# EAGLE design expansion_module_USB_host (EAGLE 9.6.2)
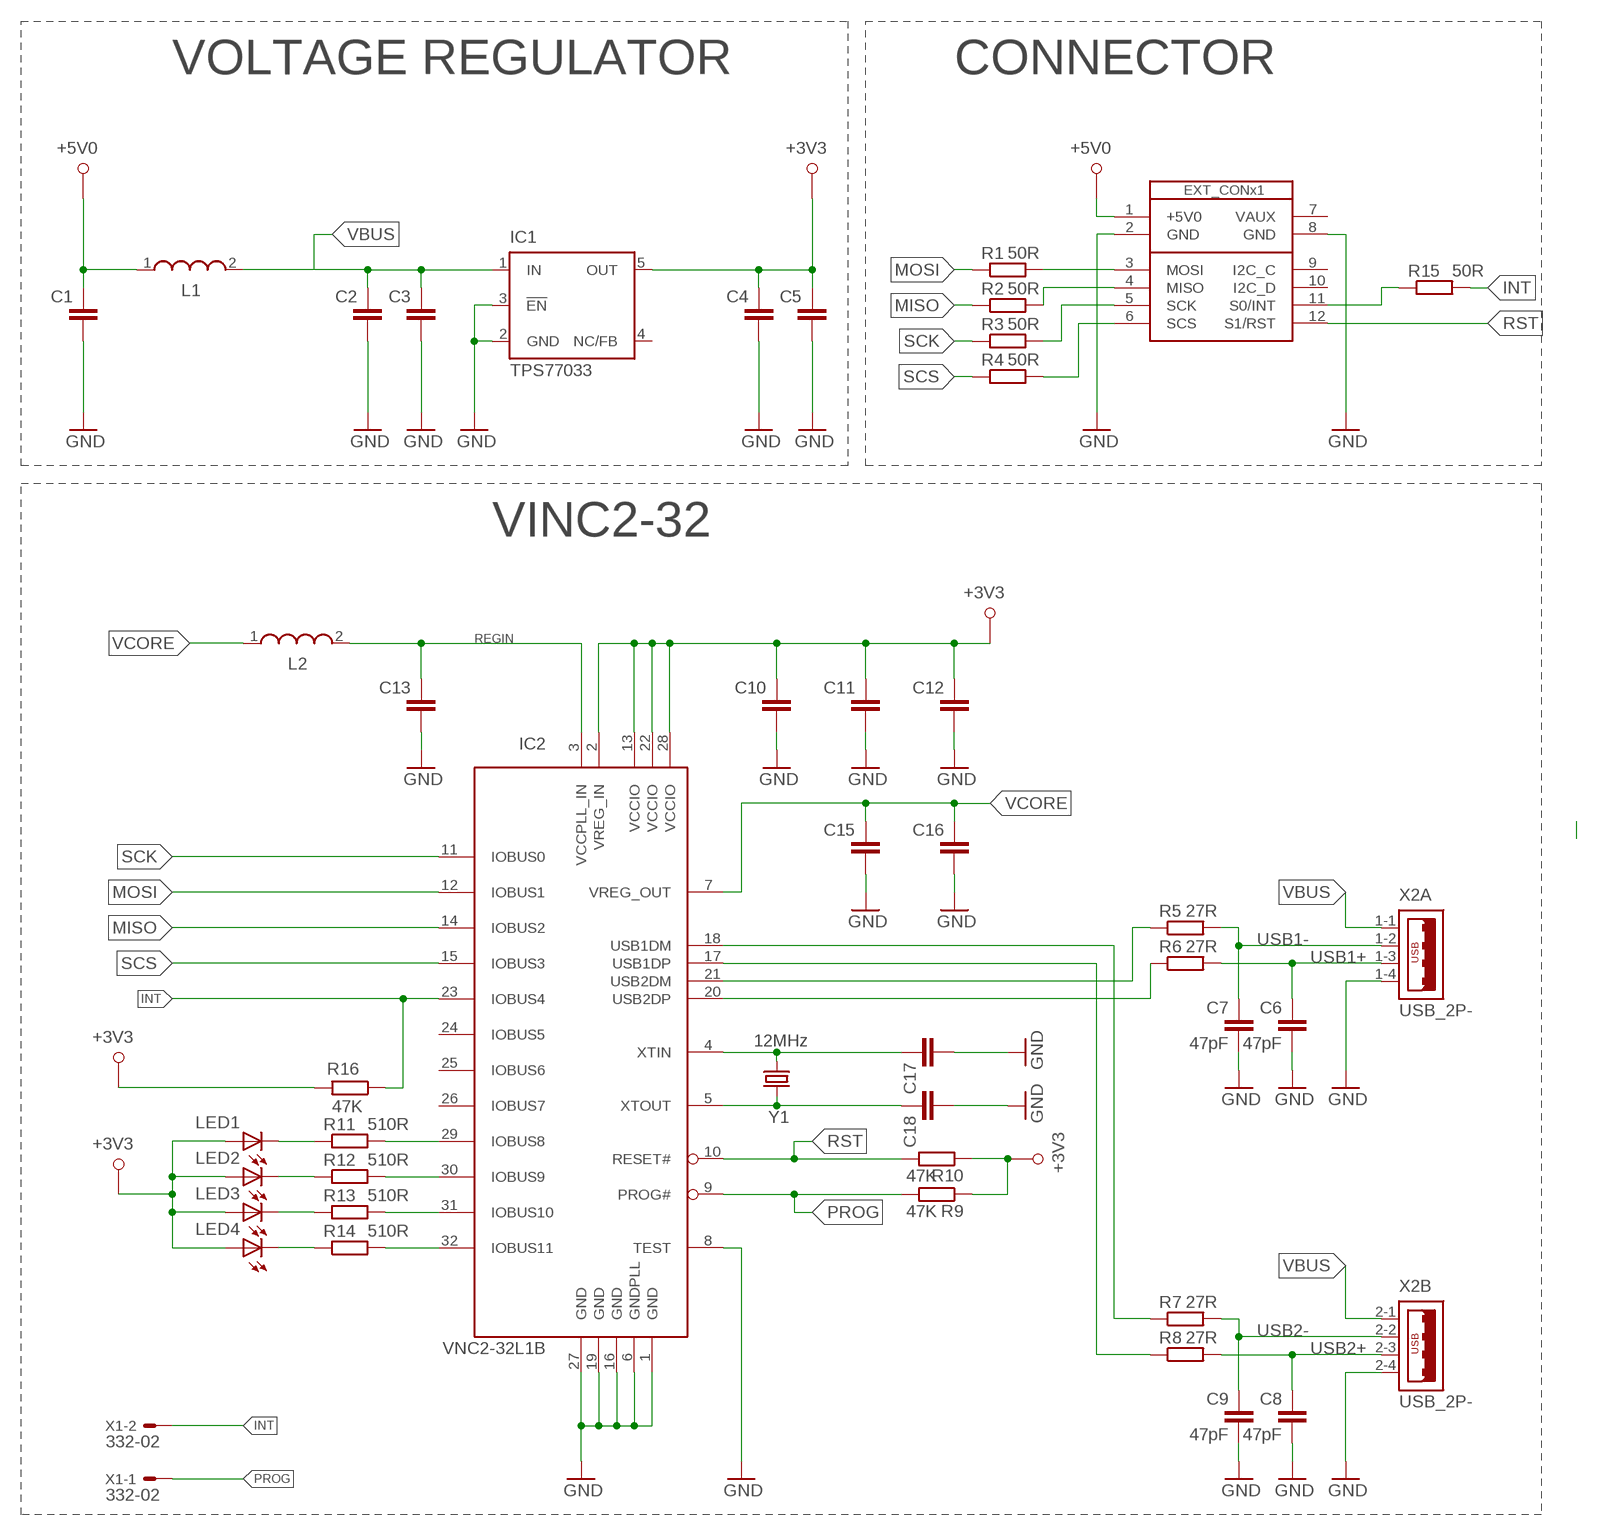
[diagram p0: schematic, sheet 1]

## Parts
C1  C-EUC0805  [C0805]
C2  C-EUC0805  [C0805]
C3  C-EUC0805  [C0805]
C4  C-EUC0805  [C0805]
C5  C-EUC0805  [C0805]
C6  47pF  C-EUC0805  [C0805]
C7  47pF  C-EUC0805  [C0805]
C8  47pF  C-EUC0805  [C0805]
C9  47pF  C-EUC0805  [C0805]
C10  C-EUC0805  [C0805]
C11  C-EUC0805  [C0805]
C12  C-EUC0805  [C0805]
C13  C-EUC0805  [C0805]
C15  C-EUC0805  [C0805]
C16  C-EUC0805  [C0805]
C17  C-EUC0805  [C0805]
C18  C-EUC0805  [C0805]
IC1  TPS77033  [SOT23-DBV]
IC2  VNC2-32L1B  [LQFP32]
L1  WE-LQ_1210  [WE-LQ_M]
L2  WE-LQ_1210  [WE-LQ_M]
LED1  LEDCHIPLED_0805  [CHIPLED_0805]
LED2  LEDCHIPLED_0805  [CHIPLED_0805]
LED3  LEDCHIPLED_0805  [CHIPLED_0805]
LED4  LEDCHIPLED_0805  [CHIPLED_0805]
R1  50R  R-EU_R0805  [R0805]
R2  50R  R-EU_R0805  [R0805]
R3  50R  R-EU_R0805  [R0805]
R4  50R  R-EU_R0805  [R0805]
R5  27R  R-EU_R0805  [R0805]
R6  27R  R-EU_R0805  [R0805]
R7  27R  R-EU_R0805  [R0805]
R8  27R  R-EU_R0805  [R0805]
R9  47K  R-EU_R0805  [R0805]
R10  47K  R-EU_R0805  [R0805]
R11  510R  R-EU_R0805  [R0805]
R12  510R  R-EU_R0805  [R0805]
R13  510R  R-EU_R0805  [R0805]
R14  510R  R-EU_R0805  [R0805]
R15  50R  R-EU_R0805  [R0805]
R16  47K  R-EU_R0805  [R0805]
U$1  SB_EXT_CON_X1_SPI  [SB_EXT_CON_X1_FULL]
X1  332-02  [332-02]
X2  USB_2P-  [85-32003-00X-1_DUAL]
Y1  12MHz  CRYSTALCRYSTAL-SMD-5X3-12MHZ  [CRYSTAL-SMD-5X3]

## Nets
+3V3: C4.2 C5.2 C10.2 C11.2 C12.2 IC1.5(OUT) IC2.2(VREG_IN) IC2.13(VCCIO) IC2.22(VCCIO) IC2.28(VCCIO) LED1.A LED2.A LED3.A LED4.A R9.1 R10.1 R16.2
+5V0: C1.2 L1.1 U$1.1(+5V0)
GND: C1.1 C2.1 C3.1 C4.1 C5.1 C6.1 C7.1 C8.1 C9.1 C10.1 C11.1 C12.1 C13.1 C15.1 C16.1 C17.1 C18.1 IC1.2(GND) IC1.3(!EN) IC2.1(GND) IC2.6(GNDPLL) IC2.8(TEST) IC2.16(GND) IC2.19(GND) IC2.27(GND) U$1.2(GND) U$1.8(GND) X2.1-4 X2.2-4
INT: IC2.23(IOBUS4) R15.2 R16.1 X1.2
MISO: IC2.14(IOBUS2) R2.1
MOSI: IC2.12(IOBUS1) R1.1
N$1: R1.2 U$1.3(MOSI)
N$2: R2.2 U$1.4(MISO)
N$3: R3.2 U$1.5(SCK)
N$4: R4.2 U$1.6(SCS)
N$6: LED1.C R11.1
N$7: IC2.29(IOBUS8) R11.2
N$8: C17.2 IC2.4(XTIN) Y1.1
N$9: IC2.21(USB2DM) R5.1
N$11: C18.2 IC2.5(XTOUT) Y1.3
N$12: IC2.18(USB1DM) R7.1
N$13: IC2.17(USB1DP) R8.1
N$14: IC2.30(IOBUS9) R12.2
N$16: IC2.31(IOBUS10) R13.2
N$17: IC2.32(IOBUS11) R14.2
N$22: LED2.C R12.1
N$23: LED3.C R13.1
N$24: LED4.C R14.1
N$25: IC2.20(USB2DP) R6.1
N$33: R15.1 U$1.11(S0/INT)
PROG: IC2.9(PROG#) R9.2 X1.1
REGIN: C13.2 IC2.3(VCCPLL_IN) L2.2
RST: IC2.10(RESET#) R10.2 U$1.12(S1/RST)
SCK: IC2.11(IOBUS0) R3.1
SCS: IC2.15(IOBUS3) R4.1
USB1+: C6.2 R6.2 X2.1-3
USB1-: C7.2 R5.2 X2.1-2
USB2+: C8.2 R8.2 X2.2-3
USB2-: C9.2 R7.2 X2.2-2
VBUS: C2.2 C3.2 IC1.1(IN) L1.2 X2.1-1 X2.2-1
VCORE: C15.2 C16.2 IC2.7(VREG_OUT) L2.1
Unconnected: IC1.4(NC/FB) IC2.24(IOBUS5) IC2.25(IOBUS6) IC2.26(IOBUS7) U$1.7(VAUX) U$1.9(I2C_C) U$1.10(I2C_D)

## Notes on the sheet
- VOLTAGE REGULATOR | CONNECTOR
- VINC2-32

## Library data of the parts
C1-C13 C15-C18 = resistor:C-EU: CAPACITOR, European symbol
IC1 = texas:TPS770*: ULTRALOW-POWER 50-mA LOW-DROPOUT LINEAR REGULATORS 50-mA Low-Dropout Regulator Source: http://focus.ti.com/lit/ds/symlink/tps77001.pdf; MF: TEXAS INSTRUMENTS; MPN: TPS77033DBVT; OC_FARNELL: 8461570; OC_NEWARK: 77C1187
IC2 = ftdichip-6:VNC2-32: Vinculum-II 2nd Generation Dual USB Host Controller
L1 L2 = EagleLibrary_Wuerth_Elektronik_eiSos_rev16a:WE-LQ: SMD Inductor Characteristics Miniature chip inductor wound on a special ferrite core Small inductances for compact circuits High Q at high frequencies Low DC-resistance Operating temperature: –40 ºC to +125 ºC Applications Low power DC/DC-converters from Linear Technology, National Semiconductor, Texas Instruments, Fairchild Semiconductor, ON Semiconductor, STMicroelectronics, Maxim, MPS, Semtech, Exar, Analogic Tech, Diodes and Cologne Chip EMI-Filtering RF-circuits <http://katalog.we-online.de/media/images/eisos/IndLQ_pf2.jpg> Details see: http://katalog.we-online.de/en/pbs/WE-LQ? Updated by Dan Xu 2014-07-08 2014 (C) Wurth Elektronik
LED1-LED4 = adafruit:LED: LED OSRAM: - CHIPLED LG R971, LG N971, LY N971, LG Q971, LY Q971, LO R971, LY R971 LH N974, LH R974 LS Q976, LO Q976, LY Q976 LO Q996 - Hyper CHIPLED LW Q18S LB Q993, LB Q99A, LB R99A - SideLED LS A670, LO A670, LY A670, LG A670, LP A670 LB A673, LV A673, LT A673, LW A673 LH A674 LY A675 LS A676, LA A676, LO A676, LY A676, LW A676 LS A679, LY A679, LG A679 - Hyper Micro SIDELED® LS Y876, LA Y876, LO Y876, LY Y876 LT Y87S - SmartLED LW L88C, LW L88S LB L89C, LB L89S, LG L890 LS L89K, LO L89K, LY L89K LS L896, LA L896, LO L896, LY L896 - TOPLED LS T670, LO T670, LY T670, LG T670, LP T670 LSG T670, LSP T670, LSY T670, LOP T670, LYG T670 LG T671, LOG T671, LSG T671 LB T673, LV T673, LT T673, LW T673 LH T674 LS T676, LA T676, LO T676, LY T676, LB T676, LH T676, LSB T676, LW T676 LB T67C, LV T67C, LT T67C, LS T67K, LO T67K, LY T67K, LW E67C LS E67B, LA E67B, LO E67B, LY E67B, LB E67C, LV E67C, LT E67C LW T67C LS T679, LY T679, LG T679 LS T770, LO T770, LY T770, LG T770, LP T770 LB T773, LV T773, LT T773, LW T773 LH T774 LS E675, LA E675, LY E675, LS T675 LS T776, LA T776, LO T776, LY T776, LB T776 LHGB T686 LT T68C, LB T68C - Hyper Mini TOPLED® LB M676 - Mini TOPLED Santana® LG M470 LS M47K, LO M47K, LY M47K Source: http://www.osram.convergy.de/
R1-R16 = resistor:R-EU_: RESISTOR, European symbol
U$1 = al_smartboard:SB_EXT_CON_X1_SPI
X1 = con-garry:332-02: 2 Pin - 2mm Dual Row Source: www.mpe-connector.de / garry_shortform_2012.pdf
X2 = con-cypressindustries_2:USB_2P-: Triple USB Connector Source: www.cypressindustries.com
Y1 = SparkFun-FreqCtrl:CRYSTAL: Various standard crystals. Proven footprints.; PROD_ID: XTAL-08297

## Net classes
0 default: clearance 0.205 mm

## Board
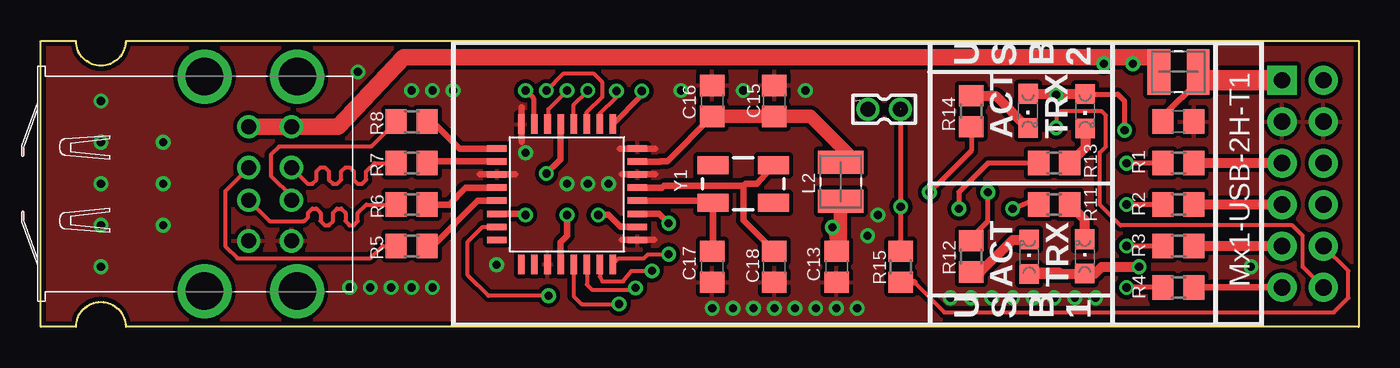
[diagram p1: board, top side]
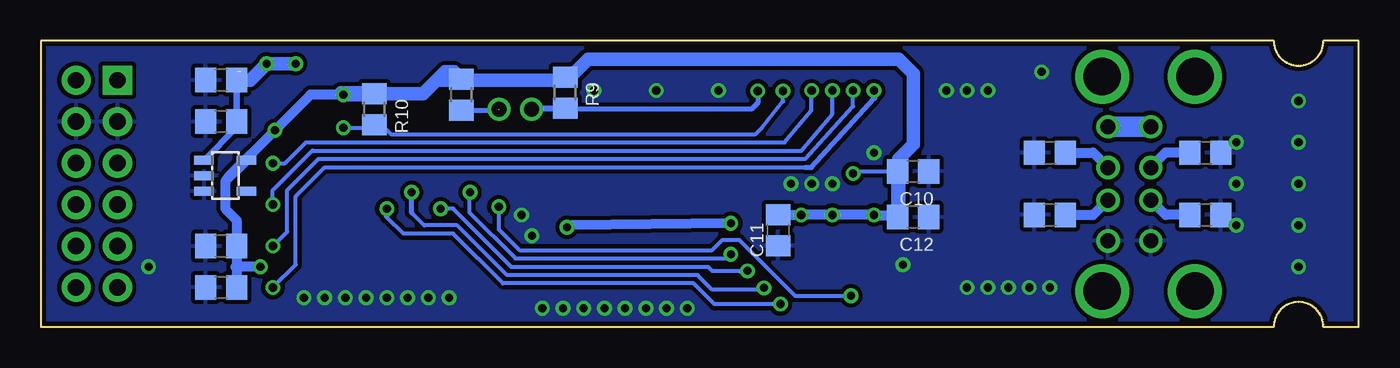
[diagram p2: board, bottom side, seen from below]

Size 80.77 x 17.53 mm. Coordinates in mm from the lower left corner, seen from the top.
Copper layers (1*16): Top 0.035mm / dielectric 1.5mm / Bottom 0.035mm
Design rules "default *": minimum track width 10mil, minimum drill 24mil, track to track 8mil, track to pad 8mil, pad to pad 8mil, via to via 8mil, smd to smd 8mil, copper to edge 10mil, drill to drill 20mil, minimum pad ring 10mil, minimum via ring 8mil, stop-mask expansion 4mil, vias tented up to drill 30mil, thermal gap 10mil

### Footprints (pad centres in the part's own frame; a part is rotated, then mirrored left to right if it is on the bottom)
C0805 = smd 1.3 x 1.5: 1 -0.95,0; 2 0.95,0
SOT23-DBV = smd 0.55 x 1.2: 1 -0.95,-1.3; 2 0,-1.3; 3 0.95,-1.3; 4 0.95,1.3; 5 -0.95,1.3
LQFP32 = smd 0.4 x 1.2: 1 -2.8,-4.3; 2 -2,-4.3; 3 -1.2,-4.3; 4 -0.4,-4.3; 5 0.4,-4.3; 6 1.2,-4.3; 7 2,-4.3; 8 2.8,-4.3; 17 2.8,4.3; 18 2,4.3; 19 1.2,4.3; 20 0.4,4.3; 21 -0.4,4.3; 22 -1.2,4.3; 23 -2,4.3; 24 -2.8,4.3 | smd 1.2 x 0.4: 9 4.3,-2.8; 10 4.3,-2; 11 4.3,-1.2; 12 4.3,-0.4; 13 4.3,0.4; 14 4.3,1.2; 15 4.3,2; 16 4.3,2.8; 25 -4.3,2.8; 26 -4.3,2; 27 -4.3,1.2; 28 -4.3,0.4; 29 -4.3,-0.4; 30 -4.3,-1.2; 31 -4.3,-2; 32 -4.3,-2.8
WE-LQ_M = smd 1.4 x 2.8: 1 -1.2,0; 2 1.2,0
CHIPLED_0805 = smd 1.2 x 1.2: A 0,-1.05; C 0,1.05
R0805 = smd 1.3 x 1.5: 1 -0.95,0; 2 0.95,0
SB_EXT_CON_X1_FULL = drill 1 pad 1.778 square: 1 15.24,5.08 | drill 1 pad 1.778: 2 12.7,5.08; 3 10.16,5.08; 4 7.62,5.08; 5 5.08,5.08; 6 2.54,5.08; 7 15.24,2.54; 8 12.7,2.54; 9 10.16,2.54; 10 7.62,2.54; 11 5.08,2.54; 12 2.54,2.54
332-02 = drill 0.9 pad 1.27: 1 0,-1; 2 0,1
85-32003-00X-1_DUAL = drill 0.92 pad 1.27: 1-1 2.71,3.5; 1-2 2.71,1; 1-3 2.71,-1; 1-4 2.71,-3.5; 2-1 5.33,3.5; 2-2 5.33,1; 2-3 5.33,-1; 2-4 5.33,-3.5 | drill 2.3 pad 3: M1 0,6.57; M2 0,-6.57; M3 5.68,6.57; M4 5.68,-6.57
CRYSTAL-SMD-5X3 = smd 1.9 x 1.1: 1 -1.85,-1.15; 2 1.85,-1.15; 3 1.85,1.15; 4 -1.85,1.15

### Placement (x,y rotation side)
C1  69.72,12.57 180 top
C2  69.72,15.11 0 bottom
C3  69.72,12.57 0 bottom
C4  69.72,2.41 0 bottom
C5  69.72,4.95 0 bottom
C6  9.4,6.86 180 bottom
C7  9.4,10.67 180 bottom
C8  18.92,6.86 0 bottom
C9  18.92,10.67 0 bottom
C10  27.3,9.53 180 bottom
C11  35.59,5.92 90 bottom
C12  27.3,6.73 180 bottom
C13  48.77,3.68 90 top
C15  44.96,13.84 270 top
C16  41.15,13.84 270 top
C17  41.15,3.68 90 top
C18  44.96,3.68 90 top
IC1  69.47,9.27 270 bottom
IC2  32.26,8.13 90 top
L1  69.72,15.62 180 top
L2  49.02,8.89 270 top
LED1  63.98,4.32 0 top
LED2  60.58,4.29 0 top
LED3  64.01,13.21 180 top
LED4  60.5,13.23 180 top
R1  69.72,10.03 0 top
R2  69.72,7.49 0 top
R3  69.72,4.95 0 top
R4  69.72,2.41 0 top
R5  22.73,4.95 180 top
R6  22.73,7.49 180 top
R7  22.73,10.03 180 top
R8  22.73,12.57 180 top
R9  48.64,14.35 270 bottom
R10  60.33,13.33 270 bottom
R11  62.1,7.49 180 top
R12  57.02,4.32 90 top
R13  62.1,10.03 180 top
R14  57.02,13.21 270 top
R15  52.7,3.68 90 top
R16  54.99,14.22 90 bottom
U$1  81.15,-0.13 90 top
X1  51.69,13.33 270 top
X2  10.03,8.76 0 top
Y1  43.05,8.76 0 top

### Tracks (layer width: path | path; a pad name or v marks a point on that pad's centre or on a via)
+3V3  (via drill 0.5)
  Top 0.305: LED3.A 66.01,14.26 66.42,13.84 v66.42,12.04
  Top 0.406: IC2.22 29.65,6.93 v29.72,6.86 | IC2.28 31.86,5.19 32.26,5.59 v32.26,6.86 | IC2.2 35.53,6.13 34.8,6.86 v34.16,6.86 | IC2.13 31.86,10.27 v30.99,9.4
  Top 0.61: LED4.A 63.98,14.28 LED3.A | v67.31,3.68 65.02,3.68 64.61,3.27 LED1.A LED2.A 60.89,3.3 62.48,3.3
  Bottom 0.254: v30.99,9.4 30.86,9.53 C10.2 | C4.2 68.77,3.62 68.83,3.68
  Bottom 0.305: R10.1 60.39,14.22 v62.23,14.22
  Bottom 0.406: C5.2 68.71,4.95 | C10.2 28.26,6.88 28.13,6.76
  Bottom 0.61: 69.47,8.92 69.22,9.27 v66.42,12.04 64.24,14.22 v62.23,14.22 | 69.47,8.92 69.47,7.24 68.77,6.54 C5.2 C4.2 | IC1.5 69.47,8.92 | 28.13,6.76 28.34,6.8 29.52,6.8 v29.72,6.86 v32.26,6.86 v34.16,6.86 C11.2 | v67.31,3.68 68.83,3.68
  Bottom 0.813: 59.88,14.22 v62.23,14.22 62.36,14.35 60.57,14.35 LED4.A 57.34,14.28 56.52,15.11 | 56.52,15.11 48.83,15.11 R9.1 48.33,15.3 47.24,16.38 28.19,16.38 27.3,15.49 27.3,11.18 28.19,10.29 28.19,6.79 C12.2 C10.2 28.07,9.71 | 56.52,15.11 56.01,15.62 55.44,15.62 R16.2
+5V0
  Top 0.406: C1.2 68.77,12.89 70.99,15.11 70.99,15.55 L1.1
  Top 1.27: U$1.1 70.99,15.11
GND  (via drill 0.5)
  Top 0.406: 26.92,9.35 29.06,9.35 | 29.46,13.46 29.46,11.33 | 37.64,10.92 35.51,10.92 | 37.64,9.35 35.61,9.35 | 35.61,5.33 37.59,5.33
  other vias: 19.43,15.62 7.49,6.22 7.49,8.76 7.49,11.3 3.68,13.84 3.68,11.3 3.68,8.76 3.68,6.22 3.68,3.68 18.92,2.41 20.19,2.41 21.46,2.41 22.73,2.41 24,2.41 24,14.48 22.73,14.48 25.27,14.48 29.72,10.67 34.8,8.76 33.53,8.76 32.26,8.76 57.02,1.78 58.29,1.78 59.56,1.78 60.83,1.78 62.1,1.78 63.37,1.78 64.64,1.78 55.75,1.78 43.05,14.48 46.86,14.48 39.24,14.48 48.77,1.14 44.96,1.14 41.15,1.14 42.42,1.14 43.69,1.14 46.23,1.14 47.5,1.14 50.04,1.14 50.67,5.59 51.31,6.86 74.17,3.68 27.94,3.81
  pour Top (isolate 0.254): 81.25,17.81 -0.13,17.78 -0.13,-1.52 81.31,-1.52
  pour Bottom (isolate 0.254): 81.28,18.16 81.28,-0.13 -0.13,-0.13 -0.13,18.16
INT  (via drill 0.5)  (1 unrouted)
  Top 0.254: v31.12,1.91 27.43,1.91 26.16,3.17 26.16,5.21 27.08,6.13 IC2.23
  Top 0.305: R15.2 v52.7,7.37 52.7,13.33
  Bottom 0.254: v52.7,7.37 52.7,5.97 51.44,4.7 39.62,4.7 38.99,5.33 37.97,5.33 34.54,1.91 v31.12,1.91
  Bottom 0.305: R16.1 52.75,13.27 X1.2
MISO  (via drill 0.5)
  Top 0.254: IC2.14 31.12,12.43 31.12,13.33 v32.26,14.48
  Top 0.305: R2.1 v66.55,7.49
  Bottom 0.254: v66.55,7.49 66.55,8.38 64.14,10.79 34.16,10.79 32.26,13.03 v32.26,14.48
MOSI  (via drill 0.5)
  Top 0.254: IC2.12 32.66,13.61 v33.53,14.48
  Top 0.305: R1.1 v66.55,10.03
  Bottom 0.254: v66.55,10.03 65.79,10.03 64.52,11.3 35.18,11.3 33.55,13.26 v33.53,14.48
N$1
  Top 0.61: U$1.3 R1.2
N$2
  Top 0.61: U$1.4 R2.2
N$3
  Top 0.61: U$1.5 R3.2
N$4
  Top 0.406: U$1.6 R4.2
N$5  (via drill 0.5)
  other vias: 65.15,16.13
N$6
  Top 0.61: LED1.C 63.98,6.56 R11.1
N$7  (via drill 0.5)
  Top 0.254: IC2.29 32.66,1.88 33.15,1.4 v35.43,1.4
  Top 0.305: R11.2 60.9,7.75 v59.56,7.24
  Bottom 0.254: v35.43,1.4 39.5,1.4 40.77,2.67 52.45,2.67 55.5,5.71 58.55,5.71 59.56,6.73
  Bottom 0.305: 59.56,6.73 v59.56,7.24
N$8
  Top 0.406: C17.2 41.2,4.69 Y1.1 41.09,7.73 IC2.4
N$9
  Top 0.406: R5.1 24,4.95 26.78,7.73 IC2.21
N$11
  Top 0.406: Y1.3 43.88,8.76 43.18,8.76 43.05,8.64 | 43.05,8.64 43.05,6.54 C18.2 | 43.05,8.64 38.19,8.64 38.08,8.53 IC2.5
N$12
  Top 0.406: R7.1 24,10.03 24.13,10.16 27.93,10.16 IC2.18
N$13
  Top 0.406: R8.1 24,12.57 25.65,10.92 27.95,10.92 IC2.17
N$14  (via drill 0.5)
  Top 0.254: IC2.30 33.48,3.81 33.48,2.59 33.78,2.29 36.55,2.29 v36.45,2.39
  Top 0.305: R12.2 57.02,5.46 58.04,6.48 v58.04,8.25
  Bottom 0.254: v36.45,2.39 36.6,2.29 39.62,2.29 40.51,3.17 52.2,3.17 55.25,6.22 57.28,6.22 58.04,6.98
  Bottom 0.305: 58.04,6.98 v58.04,8.25
N$16  (via drill 0.5)
  Top 0.254: IC2.31 34.27,3.82 34.27,3.07 34.42,2.79 35.69,2.79 36.2,3.43 v37.46,3.43
  Top 0.305: R13.2 58.04,10.03 56.26,8.25 v56.26,7.24
  Bottom 0.254: 37.92,3.4 v37.46,3.43 39.62,3.43 39.88,3.68 51.94,3.68 55.5,7.24 v56.26,7.24
  Bottom 0.305: 56.01,7.01 v56.26,7.24
N$17  (via drill 0.5)
  Top 0.254: IC2.32 35.42,4.19 36.96,4.19 37.21,4.44 v38.48,4.44
  Top 0.305: R14.2 57.02,10.79 55.25,9.02 v54.46,8.25
  Bottom 0.254: v54.46,8.25 54.48,8.23 54.48,6.98 51.69,4.19 38.73,4.19 v38.48,4.44
N$22
  Top 0.61: R12.1 57.6,3.37 59.56,5.33 60.82,5.33 LED2.C
N$23
  Top 0.61: LED3.C 64.01,10.99 R13.1
N$24
  Top 0.61: R14.1 58.53,14.16 LED4.C
N$25
  Top 0.406: R6.1 25.02,7.49 26.03,8.51 27.94,8.51 IC2.20
N$33
  Top 0.254: 53.53,2.73 55.37,0.89 79.25,0.89 80.14,1.78 80.14,3.43 U$1.11
  Top 0.406: 53.53,2.73 R15.1
PROG  (via drill 0.5)
  Top 0.305: IC2.9 36.83,14.2 v36.83,14.45
  Bottom 0.305: v36.83,14.45 36.83,13.72 37.21,13.33 X1.1 50.62,13.4 R9.2
REGIN  (via drill 0.5)
  Top 0.406: IC2.3 37.9,6.93 v38.48,6.35
  Top 0.61: v48.51,6.1 C13.2
  Top 0.813: C13.2 49.02,4.89 L2.2
  Bottom 0.61: v38.48,6.35 48.26,6.22 v48.51,6.1
RST  (via drill 0.5)
  Top 0.254: U$1.12 77.34,3.68 77.34,5.59 76.71,6.22 66.17,6.22 64.9,7.49 64.9,10.67 65.28,11.05 65.28,12.95 65.02,13.21 62.48,13.21 62.23,12.95 v62.23,12.19 | IC2.10 34.26,13.05 35.28,14.07 v35.28,14.45
  Bottom 0.254: v62.23,12.19 60.33,12.19 | 35.28,14.48 v35.28,14.45 35.28,13.82 36.58,12.19 36.96,11.81 59.31,11.81 59.88,12.38 R10.2
  Bottom 0.305: 60.33,12.19 R10.2
SCK  (via drill 0.5)
  Top 0.254: IC2.11 33.46,13.14 34.42,14.1 34.42,14.99 33.91,15.49 32,15.49 v30.99,14.48
  Top 0.305: R3.1 v66.55,4.95
  Bottom 0.254: v66.55,4.95 65.66,5.84 65.66,8.38 63.75,10.29 33.91,10.29 30.99,13.51 v30.99,14.48
SCS  (via drill 0.5)
  Top 0.254: IC2.15 30.23,12.4
  Top 0.305: R4.1 v66.55,2.41 | IC2.15 30.23,12.46 30.23,13.97 v29.72,14.48
  Bottom 0.254: v66.55,2.41 65.15,3.81 65.15,8 63.37,9.78 33.91,9.78
  Bottom 0.305: 33.91,9.78 33.53,9.78 29.67,13.99 v29.72,14.48
USB1+
  Top 0.254: X2.1-3 14.03,6.48 16.13,6.48 16.38,6.73 16.38,6.98 16.64,7.24 16.89,7.24 17.14,6.98 17.14,6.48 17.4,6.22 17.65,6.22 17.91,6.48 17.91,6.98 18.16,7.24 18.41,7.24 18.67,6.98 18.67,6.48 18.92,6.22 19.18,6.22 19.43,6.48 19.43,6.98 19.94,7.49 R6.2
  Bottom 0.61: C6.2 11.84,6.86 X2.1-3
USB1-
  Top 0.254: X2.1-2 11.3,8.32 11.3,4.95 12.07,4.19 20.19,4.19 20.95,4.95 R5.2
  Bottom 0.61: C7.2 11.84,10.67 X2.1-2
USB2+
  Top 0.254: R8.2 20.26,11.05 14.61,11.05 14.1,10.54 14.1,9.27 15.36,8 X2.2-3
  Bottom 0.61: C8.2 16.27,6.86 X2.2-3
USB2-
  Top 0.254: 21.51,9.76 R7.2 20.45,10.03 19.94,9.53 19.94,9.02 19.69,8.76 19.43,8.76 19.18,9.02 19.18,9.53 18.92,9.78 18.67,9.78 18.41,9.53 18.41,9.02 18.16,8.76 17.91,8.76 17.65,9.02 17.65,9.53 17.4,9.78 17.14,9.78 16.89,9.53 16.89,9.02 16.64,8.76 16.36,8.76 X2.2-2
  Bottom 0.61: C9.2 16.27,10.67 X2.2-2
VBUS  (via drill 0.5)  (1 unrouted)
  Top 1.016: L1.2 68.45,15.62 68.45,16.51 22.23,16.51 18.23,12.26 X2.1-1
  Bottom 0.406: IC1.1 68.77,12.22 C3.2 C2.2 68.71,15.62
  Bottom 0.813: C2.2 67.94,15.11 v66.93,16.13 65.15,16.13
  Bottom 1.27: X2.2-1 X2.1-1
VCORE
  Top 0.406: 40.95,12.7 C16.2 38.41,10.16 37.97,10.16 37.94,10.13 IC2.7
  Top 0.813: C16.2 C15.2 47.18,12.89 49.4,10.67 49.4,10.47 L2.1

### Text on the board
tNames: U / S / B / 2 | ACT | TRX | Mx1-USB-2H-T1 | ACT | TRX | U / S / B / 1